# EAGLE design collision (EAGLE 6.5.0)
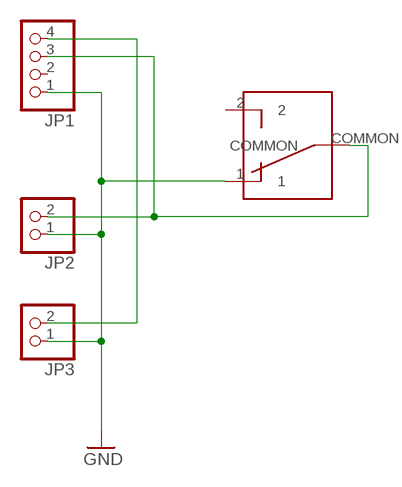
[diagram p0: schematic, sheet 1]

## Parts
JP1  PINHD-1X4/90  [1X04/90]
JP2  PINHD-1X2/90  [1X02/90]
JP3  PINHD-1X2/90  [1X02/90]
U$1  LEVER_SWITCH  [LEVER_SWITCH]

## Nets
GND: JP1.1 JP2.1 JP3.1 U$1.1
N$1: JP1.3 JP2.2 U$1.COMMON
N$3: JP1.4 JP3.2
Unconnected: JP1.2 U$1.2

## Library data of the parts
JP1 = pinhead:PINHD-1X4: PIN HEADER
JP2 JP3 = pinhead:PINHD-1X2: PIN HEADER
U$1 = custom:LEVER_SWITCH

## Board
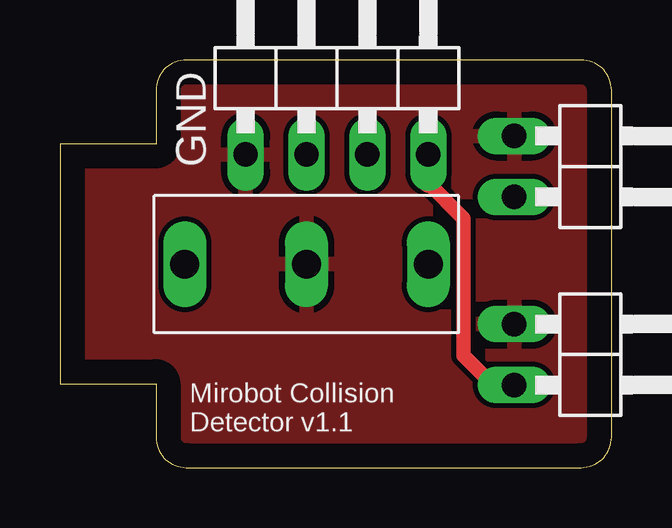
[diagram p1: board, top side]
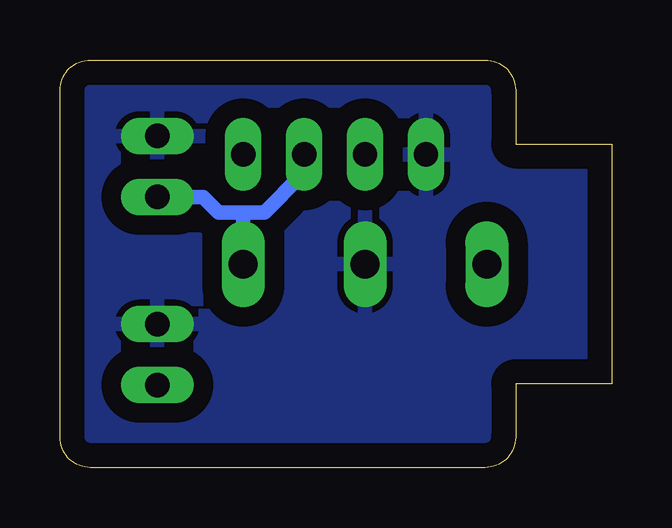
[diagram p2: board, bottom side, seen from below]

Size 23 x 17 mm. Coordinates in mm from the lower left corner, seen from the top.
Outline: 0,3.5 4,3.5 4,1.27 arc90 5.27,0 21.73,0 arc90 23,1.27 23,15.73 arc90 21.73,17 5.27,17 arc90 4,15.73 4,13.5 0,13.5 0,3.5
Copper layers (1*16): Top 0.035mm / dielectric 1.5mm / Bottom 0.035mm
Design rules "default": minimum track width 10mil, minimum drill 24mil, track to track 8mil, track to pad 8mil, pad to pad 8mil, via to via 8mil, smd to smd 8mil, copper to edge 40mil, drill to drill 8mil, minimum pad ring 10mil, minimum via ring 8mil, stop-mask expansion 4mil, vias tented up to drill 0mil, thermal gap 10mil

### Footprints (pad centres in the part's own frame; a part is rotated, then mirrored left to right if it is on the bottom)
1X04/90 = drill 1.016 long: 1 -3.81,-3.81; 2 -1.27,-3.81; 3 1.27,-3.81; 4 3.81,-3.81
1X02/90 = drill 1.016 long: 1 -1.27,-3.81; 2 1.27,-3.81
LEVER_SWITCH = drill 1.2 long: 1 0,0; 2 5.08,0; COMMON -5.08,0

### Placement (x,y rotation side)
JP1  11.55,16.87 0 top
JP2  22.75,12.56 270 top
JP3  22.75,4.71 270 top
U$1  10.28,8.48 180 top

### Tracks (layer width: path | path; a pad name or v marks a point on that pad's centre or on a via)
GND
  pour Top: 0,-0.02 23.24,-0.02 23.24,17.12 0,17.12
  pour Bottom (isolate 0.813): 0,17.12 23.24,17.12 23.24,-0.02 0,-0.02
N$1
  Bottom 0.406: 15.36,10.35 arc45 15.24,10.64
  Bottom 0.61: JP2.2 17.03,11.29 16.38,10.64 15.24,10.64 14.48,10.64 12.95,12.17 12.95,12.93 JP1.3 | U$1.COMMON 15.36,10.35
N$3
  Top 0.61: 15.36,11.86 16.83,10.39 16.83,4.67 18.1,3.41 18.91,3.41 JP3.2
  Top 0.813: JP1.4 15.36,11.86

### Text on the board
tNames: GND | Mirobot Collision / Detector v1.1